# EAGLE schematic zik-pcb-gpu-f405 (EAGLE 6.5.0)
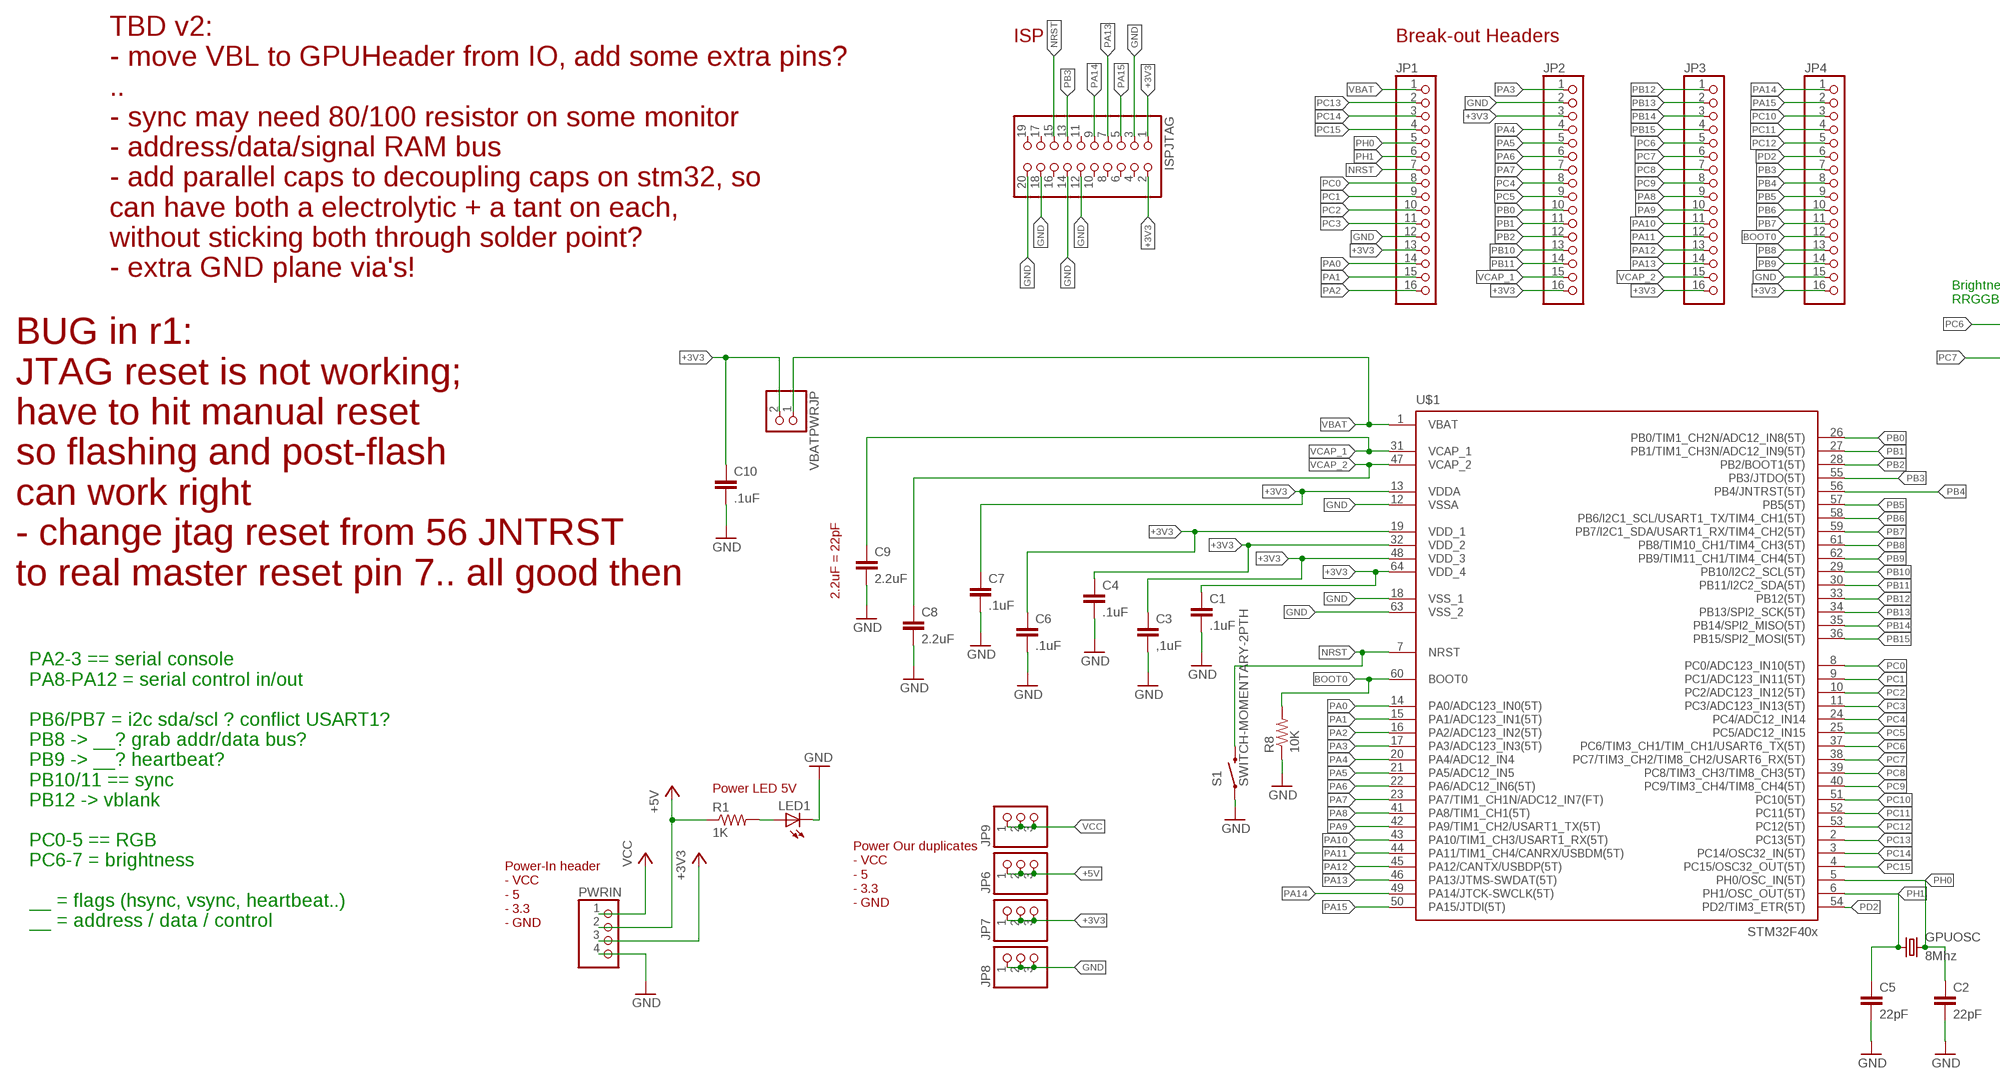
[diagram p0: schematic, sheet 1, part 1 of 2]
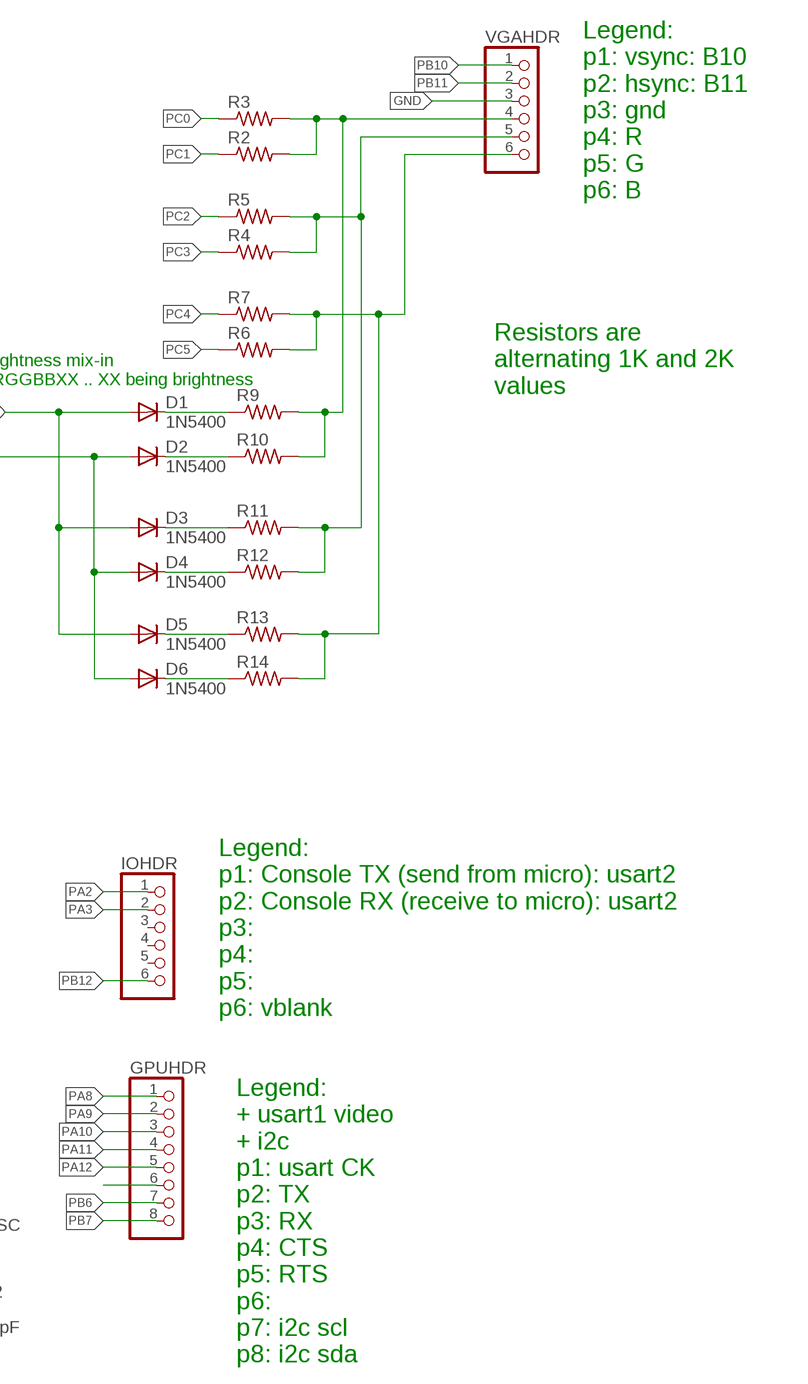
[diagram p1: schematic, sheet 1, part 2 of 2]

## Parts
C1  .1uF  C-EU025-025X050  [C025-025X050]
C2  22pF  C-EU025-025X050  [C025-025X050]
C3  ,1uF  C-EU025-025X050  [C025-025X050]
C4  .1uF  C-EU025-025X050  [C025-025X050]
C5  22pF  C-EU025-025X050  [C025-025X050]
C6  .1uF  C-EU025-025X050  [C025-025X050]
C7  .1uF  C-EU025-025X050  [C025-025X050]
C8  2.2uF  C-EU025-025X050  [C025-025X050]
C9  2.2uF  C-EU025-025X050  [C025-025X050]
C10  .1uF  C-EU025-025X050  [C025-025X050]
D1  1N5400  [DO201-15]
D2  1N5400  [DO201-15]
D3  1N5400  [DO201-15]
D4  1N5400  [DO201-15]
D5  1N5400  [DO201-15]
D6  1N5400  [DO201-15]
GPUHDR  PINHD-1X8  [1X08]
GPUOSC  8Mhz  CRYSTALHC49US  [HC49US]
IOHDR  PINHD-1X6  [1X06]
ISPJTAG  PINHD-2X10  [2X10]
JP1  PINHD-1X16  [1X16]
JP2  PINHD-1X16  [1X16]
JP3  PINHD-1X16  [1X16]
JP4  PINHD-1X16  [1X16]
JP6  PINHD-1X3  [1X03]
JP7  PINHD-1X3  [1X03]
JP8  PINHD-1X3  [1X03]
JP9  PINHD-1X3  [1X03]
LED1  LED5MM  [LED5MM]
PWRIN  PINHD-1X4  [1X04]
R1  1K  R-US_0207/10  [0207/10]
R2  R-US_0207/10  [0207/10]
R3  R-US_0207/10  [0207/10]
R4  R-US_0207/10  [0207/10]
R5  R-US_0207/10  [0207/10]
R6  R-US_0207/10  [0207/10]
R7  R-US_0207/10  [0207/10]
R8  10K  R-US_0207/10  [0207/10]
R9  R-US_0207/10  [0207/10]
R10  R-US_0207/10  [0207/10]
R11  R-US_0207/10  [0207/10]
R12  R-US_0207/10  [0207/10]
R13  R-US_0207/10  [0207/10]
R14  R-US_0207/10  [0207/10]
S1  SWITCH-MOMENTARY-2PTH  [TACTILE-PTH]
U$1  STM32F405R  [TQFP64]
VBATPWRJP  PINHD-1X2  [1X02]
VGAHDR  PINHD-1X6  [1X06]

## Nets
+3V3: C1.1 C3.1 C4.1 C6.1 C7.1 C10.1 ISPJTAG.1 ISPJTAG.2 JP1.13 JP2.3 JP2.16 JP3.16 JP4.16 JP7.1 JP7.2 JP7.3 PWRIN.3 U$1.13(VDDA) U$1.19(VDD_1) U$1.32(VDD_2) U$1.48(VDD_3) U$1.64(VDD_4) VBATPWRJP.2
+5V: JP6.1 JP6.2 JP6.3 PWRIN.2 R1.1
BOOT0: JP4.12 R8.2 U$1.60(BOOT0)
GND: C1.2 C2.2 C3.2 C4.2 C5.2 C6.2 C7.2 C8.2 C9.2 C10.2 ISPJTAG.3 ISPJTAG.12 ISPJTAG.14 ISPJTAG.18 ISPJTAG.20 JP1.12 JP2.2 JP4.15 JP8.1 JP8.2 JP8.3 LED1.K(C) PWRIN.4 R8.1 S1.1 U$1.12(VSSA) U$1.18(VSS_1) U$1.63(VSS_2) VGAHDR.3
N$3: LED1.A R1.2
N$4: D1.C R9.1
N$5: R4.2 R5.2 R11.2 R12.2 VGAHDR.5
N$7: D2.C R10.1
N$8: R6.2 R7.2 R13.2 R14.2 VGAHDR.6
N$9: R2.2 R3.2 R9.2 R10.2 VGAHDR.4
N$10: GPUHDR.6
N$12: D3.C R11.1
N$14: D4.C R12.1
N$17: D5.C R13.1
N$19: D6.C R14.1
NRST: ISPJTAG.15 JP1.7 S1.3 U$1.7(NRST)
PA0: JP1.14 U$1.14(PA0/ADC123_IN0(5T))
PA1: JP1.15 U$1.15(PA1/ADC123_IN1(5T))
PA2: IOHDR.1 JP1.16 U$1.16(PA2/ADC123_IN2(5T))
PA3: IOHDR.2 JP2.1 U$1.17(PA3/ADC123_IN3(5T))
PA4: JP2.4 U$1.20(PA4/ADC12_IN4)
PA5: JP2.5 U$1.21(PA5/ADC12_IN5)
PA6: JP2.6 U$1.22(PA6/ADC12_IN6(5T))
PA7: JP2.7 U$1.23(PA7/TIM1_CH1N/ADC12_IN7(FT))
PA8: GPUHDR.1 JP3.9 U$1.41(PA8/TIM1_CH1(5T))
PA9: GPUHDR.2 JP3.10 U$1.42(PA9/TIM1_CH2/USART1_TX(5T))
PA10: GPUHDR.3 JP3.11 U$1.43(PA10/TIM1_CH3/USART1_RX(5T))
PA11: GPUHDR.4 JP3.12 U$1.44(PA11/TIM1_CH4/CANRX/USBDM(5T))
PA12: GPUHDR.5 JP3.13 U$1.45(PA12/CANTX/USBDP(5T))
PA13: ISPJTAG.7 JP3.14 U$1.46(PA13/JTMS-SWDAT(5T))
PA14: ISPJTAG.9 JP4.1 U$1.49(PA14/JTCK-SWCLK(5T))
PA15: ISPJTAG.5 JP4.2 U$1.50(PA15/JTDI(5T))
PB0: JP2.10 U$1.26(PB0/TIM1_CH2N/ADC12_IN8(5T))
PB1: JP2.11 U$1.27(PB1/TIM1_CH3N/ADC12_IN9(5T))
PB2: JP2.12 U$1.28(PB2/BOOT1(5T))
PB3: ISPJTAG.13 JP4.7 U$1.55(PB3/JTDO(5T))
PB4: JP4.8 U$1.56(PB4/JNTRST(5T))
PB5: JP4.9 U$1.57(PB5(5T))
PB6: GPUHDR.7 JP4.10 U$1.58(PB6/I2C1_SCL/USART1_TX/TIM4_CH1(5T))
PB7: GPUHDR.8 JP4.11 U$1.59(PB7/I2C1_SDA/USART1_RX/TIM4_CH2(5T))
PB8: JP4.13 U$1.61(PB8/TIM10_CH1/TIM4_CH3(5T))
PB9: JP4.14 U$1.62(PB9/TIM11_CH1/TIM4_CH4(5T))
PB10: JP2.13 U$1.29(PB10/I2C2_SCL(5T)) VGAHDR.1
PB11: JP2.14 U$1.30(PB11/I2C2_SDA(5T)) VGAHDR.2
PB12: IOHDR.6 JP3.1 U$1.33(PB12(5T))
PB13: JP3.2 U$1.34(PB13/SPI2_SCK(5T))
PB14: JP3.3 U$1.35(PB14/SPI2_MISO(5T))
PB15: JP3.4 U$1.36(PB15/SPI2_MOSI(5T))
PC0: JP1.8 R3.1 U$1.8(PC0/ADC123_IN10(5T))
PC1: JP1.9 R2.1 U$1.9(PC1/ADC123_IN11(5T))
PC2: JP1.10 R5.1 U$1.10(PC2/ADC123_IN12(5T))
PC3: JP1.11 R4.1 U$1.11(PC3/ADC123_IN13(5T))
PC4: JP2.8 R7.1 U$1.24(PC4/ADC12_IN14)
PC5: JP2.9 R6.1 U$1.25(PC5/ADC12_IN15)
PC6: D1.A D3.A D5.A JP3.5 U$1.37(PC6/TIM3_CH1/TIM_CH1/USART6_TX(5T))
PC7: D2.A D4.A D6.A JP3.6 U$1.38(PC7/TIM3_CH2/TIM8_CH2/USART6_RX(5T))
PC8: JP3.7 U$1.39(PC8/TIM3_CH3/TIM8_CH3(5T))
PC9: JP3.8 U$1.40(PC9/TIM3_CH4/TIM8_CH4(5T))
PC10: JP4.3 U$1.51(PC10(5T))
PC11: JP4.4 U$1.52(PC11(5T))
PC12: JP4.5 U$1.53(PC12(5T))
PC13: JP1.2 U$1.2(PC13(5T))
PC14: JP1.3 U$1.3(PC14/OSC32_IN(5T))
PC15: JP1.4 U$1.4(PC15/OSC32_OUT(5T))
PD2: JP4.6 U$1.54(PD2/TIM3_ETR(5T))
PH0: C2.1 GPUOSC.2 JP1.5 U$1.5(PH0/OSC_IN(5T))
PH1: C5.1 GPUOSC.1 JP1.6 U$1.6(PH1/OSC_OUT(5T))
VBAT: JP1.1 U$1.1(VBAT) VBATPWRJP.1
VCAP_1: C9.1 JP2.15 U$1.31(VCAP_1)
VCAP_2: C8.1 JP3.15 U$1.47(VCAP_2)
VCC: JP9.1 JP9.2 JP9.3 PWRIN.1
Unconnected: IOHDR.3 IOHDR.4 IOHDR.5 ISPJTAG.4 ISPJTAG.6 ISPJTAG.8 ISPJTAG.10 ISPJTAG.11 ISPJTAG.16 ISPJTAG.17 ISPJTAG.19

## Notes on the sheet
- ISP | Break-out Headers
- Legend:
  p1: vsync: B10
  p2: hsync: B11
  p3: gnd
  p4: R
  p5: G
  p6: B
- TBD v2:
  - move VBL to GPUHeader from IO, add some extra pins?
  ..
  - sync may need 80/100 resistor on some monitor
  - address/data/signal RAM bus
  - add parallel caps to decoupling caps on stm32, so
  can have both a electrolytic + a tant on each,
  without sticking both through solder point?
  - extra GND plane via's!
- Brightness mix-in
  RRGGBBXX .. XX being brightness
- Resistors are
  alternating 1K and 2K
  values
- BUG in r1:
  JTAG reset is not working;
  have to hit manual reset
  so flashing and post-flash
  can work right
  - change jtag reset from 56 JNTRST
  to real master reset pin 7.. all good then
- 2.2uF = 22pF
- Legend:
  p1: Console TX (send from micro): usart2
  p2: Console RX (receive to micro): usart2
  p3: 
  p4: 
  p5: 
  p6: vblank
- Power LED 5V
- Power Our duplicates
  - VCC
  - 5
  - 3.3
  - GND
- Power-In header
  - VCC
  - 5
  - 3.3
  - GND
- PA2-3 == serial console
  PA8-PA12 = serial control in/out
  
  PB6/PB7 = i2c sda/scl ? conflict USART1?
  PB8 -> __? grab addr/data bus?
  PB9 -> __? heartbeat?
  PB10/11 == sync
  PB12 -> vblank
  
  PC0-5 == RGB
  PC6-7 = brightness
  
  __ = flags (hsync, vsync, heartbeat..)
  __ = address / data / control
- Legend:
  + usart1 video
  + i2c
  p1: usart CK
  p2: TX
  p3: RX
  p4: CTS
  p5: RTS
  p6:
  p7: i2c scl
  p8: i2c sda

## Library data of the parts
C1-C10 = rcl:C-EU: CAPACITOR, European symbol
D1-D6 = diode:1N5400: DIODE standard rectifier, 3 A, 50 V (Motorola)
GPUHDR = pinhead:PINHD-1X8: PIN HEADER
GPUOSC = SparkFun-FreqCtrl:CRYSTAL: Various standard crystals. Proven footprints. Spark Fun Electronics SKU : COM-00534
IOHDR VGAHDR = pinhead:PINHD-1X6: PIN HEADER
ISPJTAG = pinhead:PINHD-2X10: PIN HEADER
JP1-JP4 = pinhead:PINHD-1X16: PIN HEADER
JP6-JP9 = pinhead:PINHD-1X3: PIN HEADER
LED1 = SparkFun-LED:LED: LEDs Standard schematic elements and footprints for 5mm, 3mm, 1206, and 0603 sized LEDs. 5mm - Spark Fun Electronics SKU : COM-00529 (and others)
PWRIN = pinhead:PINHD-1X4: PIN HEADER
R1-R14 = rcl:R-US_: RESISTOR, American symbol
S1 = SparkFun-Electromechanical:SWITCH-MOMENTARY-2: Various NO switches- pushbuttons, reed, etc
U$1 = stm32f4:STM32F405R: STM32F405 64 pin LQFP reviewed: YES tested: YES
VBATPWRJP = pinhead:PINHD-1X2: PIN HEADER